# Altium project open-drain_arduino.PrjPcb
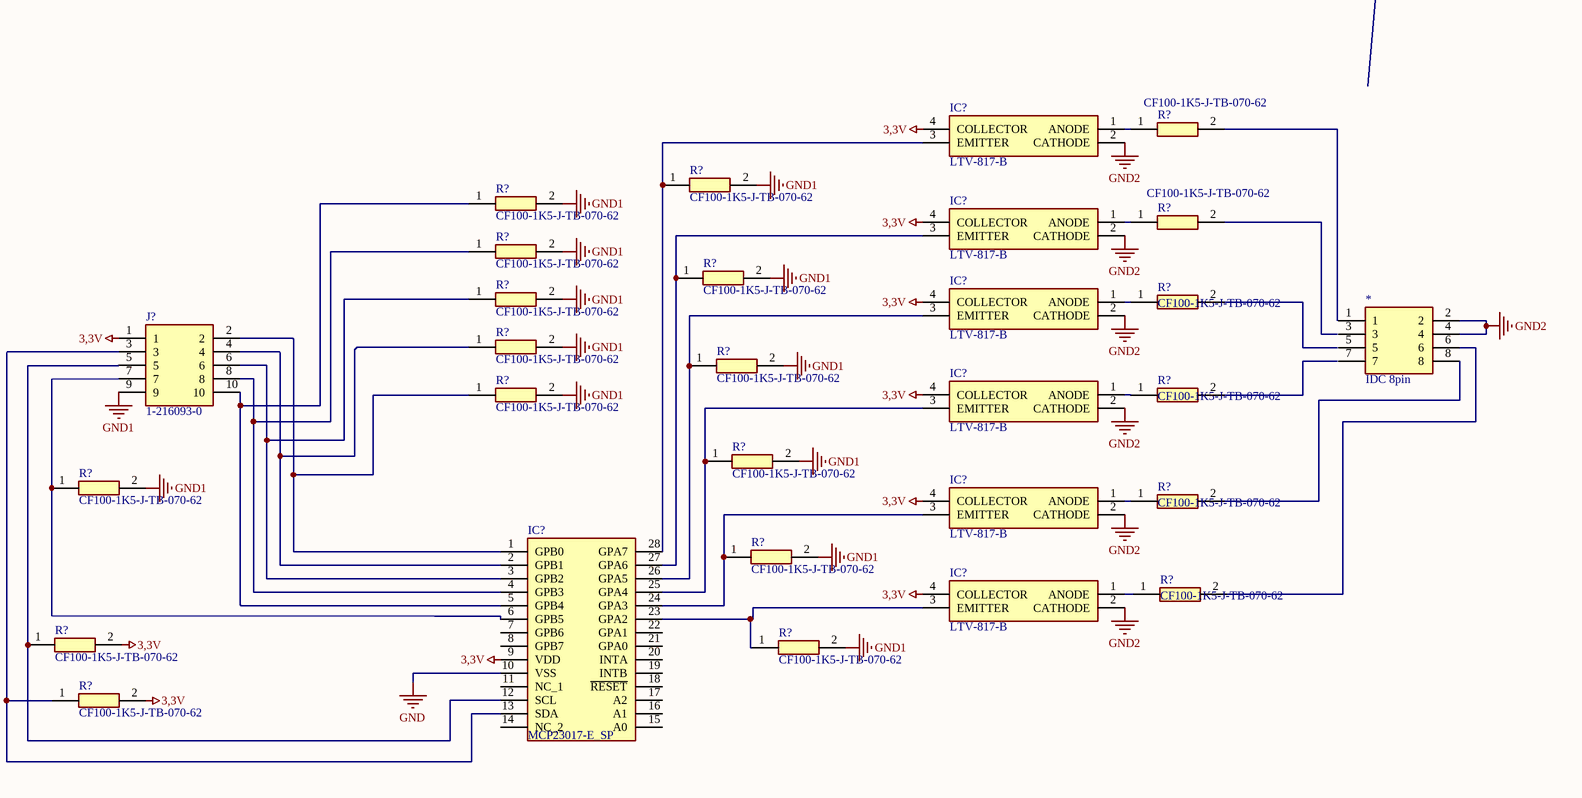
[diagram p0: optrons_and_mcp.SchDoc, bottom right]
2 sheets, 100 parts. Net scope: global (net labels, ports and power ports of the same name join across sheets).
Sheets:
  optrons_and_mcp.SchDoc
  Sheet2.SchDoc

## Sheet optrons_and_mcp.SchDoc
size A3

### Parts
(Parts that share a designator on the sheet are numbered #1, #2 ... from top to bottom, then left to right.)
*#1  IDC 8pin
IC?#1  LTV-817-B  [DIP762W60P254L460H420Q4N]
IC?#2  LTV-817-B  [DIP762W60P254L460H420Q4N]
IC?#3  LTV-817-B  [DIP762W60P254L460H420Q4N]
IC?#4  LTV-817-B  [DIP762W60P254L460H420Q4N]
IC?#5  LTV-817-B  [DIP762W60P254L460H420Q4N]
IC?#6  MCP23017-E_SP  [DIP794W56P254L3486H508Q28N]
IC?#7  LTV-817-B  [DIP762W60P254L460H420Q4N]
J?  1-216093-0  [12160930]
R?#1  CF100-1K5-J-TB-070-62  [RESAD2700W60L1100D400]
R?#2  CF100-1K5-J-TB-070-62  [RESAD2700W60L1100D400]
R?#3  CF100-1K5-J-TB-070-62  [RESAD2700W60L1100D400]
R?#4  CF100-1K5-J-TB-070-62  [RESAD2700W60L1100D400]
R?#5  CF100-1K5-J-TB-070-62  [RESAD2700W60L1100D400]
R?#6  CF100-1K5-J-TB-070-62  [RESAD2700W60L1100D400]
R?#7  CF100-1K5-J-TB-070-62  [RESAD2700W60L1100D400]
R?#8  CF100-1K5-J-TB-070-62  [RESAD2700W60L1100D400]
R?#9  CF100-1K5-J-TB-070-62  [RESAD2700W60L1100D400]
R?#10  CF100-1K5-J-TB-070-62  [RESAD2700W60L1100D400]
R?#11  CF100-1K5-J-TB-070-62  [RESAD2700W60L1100D400]
R?#12  CF100-1K5-J-TB-070-62  [RESAD2700W60L1100D400]
R?#13  CF100-1K5-J-TB-070-62  [RESAD2700W60L1100D400]
R?#14  CF100-1K5-J-TB-070-62  [RESAD2700W60L1100D400]
R?#15  CF100-1K5-J-TB-070-62  [RESAD2700W60L1100D400]
R?#16  CF100-1K5-J-TB-070-62  [RESAD2700W60L1100D400]
R?#17  CF100-1K5-J-TB-070-62  [RESAD2700W60L1100D400]
R?#18  CF100-1K5-J-TB-070-62  [RESAD2700W60L1100D400]
R?#19  CF100-1K5-J-TB-070-62  [RESAD2700W60L1100D400]
R?#20  CF100-1K5-J-TB-070-62  [RESAD2700W60L1100D400]

### Nets
3,3V: IC?#2.4(COLLECTOR) IC?#3.4(COLLECTOR) IC?#4.4(COLLECTOR) IC?#5.4(COLLECTOR) IC?#6.9(VDD) IC?#7.4(COLLECTOR) J?.1 R?#18.2 R?#20.2
GND: IC?#6.10(VSS)
GND1: J?.9 R?#2.2 R?#3.2 R?#5.2 R?#6.2 R?#7.2 R?#9.2 R?#10.2 R?#11.2 R?#13.2 R?#14.2 R?#16.2 R?#19.2
GND2: *#1.2 *#1.4 IC?#1.2(CATHODE) IC?#2.2(CATHODE) IC?#3.2(CATHODE) IC?#4.2(CATHODE) IC?#5.2(CATHODE) IC?#7.2(CATHODE)
Net*#1_6: *#1.6 R?#17.2
Net*#1_8: *#1.8 R?#15.2
NetIC?#1_1: IC?#1.1(ANODE) R?#1.1
NetIC?#1_3: IC?#1.3(EMITTER) IC?#6.28(GPA7) R?#2.1
NetIC?#2_1: IC?#2.1(ANODE) R?#4.1
NetIC?#2_3: IC?#2.3(EMITTER) IC?#6.27(GPA6) R?#6.1
NetIC?#3_1: IC?#3.1(ANODE) R?#8.1
NetIC?#3_3: IC?#3.3(EMITTER) IC?#6.26(GPA5) R?#10.1
NetIC?#4_1: IC?#4.1(ANODE) R?#12.1
NetIC?#4_3: IC?#4.3(EMITTER) IC?#6.25(GPA4) R?#13.1
NetIC?#5_1: IC?#5.1(ANODE) R?#15.1
NetIC?#5_3: IC?#5.3(EMITTER) IC?#6.24(GPA3) R?#16.1
NetIC?#6_1: IC?#6.1(GPB0) J?.2 R?#11.1
NetIC?#6_2: IC?#6.2(GPB1) J?.4 R?#9.1
NetIC?#6_3: IC?#6.3(GPB2) J?.6 R?#7.1
NetIC?#6_4: IC?#6.4(GPB3) J?.8 R?#5.1
NetIC?#6_5: IC?#6.5(GPB4) J?.10 R?#3.1
NetIC?#6_6: IC?#6.6(GPB5) J?.7 R?#14.1
NetIC?#6_12: IC?#6.12(SCL) J?.5 R?#18.1
NetIC?#6_13: IC?#6.13(SDA) J?.3 R?#20.1
NetIC?#6_23: IC?#6.23(GPA2) IC?#7.3(EMITTER) R?#19.1
NetIC?#7_1: IC?#7.1(ANODE) R?#17.1

Not connected (* = marked no-connect by the designer): *#1 1 3 5 7; IC?#1 4(COLLECTOR); IC?#6 7(GPB6) 8(GPB7) 11(NC_1) 14(NC_2) 15(A0) 16(A1) 17(A2) 18(~{RESET}) 19(INTB) 20(INTA) 21(GPA0) 22(GPA1); R?#1 2; R?#4 2; R?#8 2; R?#12 2

### Notes on the sheet
- Labels drawn without touching a wire or pin: 3,3V

### Library data of the parts
IC?#1-IC?#5 IC?#7 = LTV-817-B: Integrated Circuit; Manufacturer_Name: Lite-On; Datasheet Link: http://optoelectronics.liteon.com/upload/download/DS-70-96-0016/LTV-8X7%20series%20201610%20.pdf; Height: 4.2mm; Manufacturer_Part_Number: LTV-817-B; Mouser Part Number: N/A; Mouser Price/Stock: https://www.mouser.co.uk/ProductDetail/Lite-On/LTV-817-B?qs=5Clb0NIqk7HzP4M9tIz87Q%3D%3D; Arrow Part Number: LTV-817-B; Arrow Price/Stock: https://www.arrow.com/en/products/ltv-817-b/lite-on-technology
IC?#6 = MCP23017-E_SP: Integrated Circuit; Manufacturer_Name: Microchip; Manufacturer_Part_Number: MCP23017-E/SP; Datasheet Link: http://docs-emea.rs-online.com/webdocs/137e/0900766b8137eed4.pdf; Height: 5.08mm; Mouser Part Number: 579-MCP23017-E/SP; Mouser Price/Stock: https://www.mouser.co.uk/ProductDetail/Microchip-Technology/MCP23017-E-SP?qs=usxtMOJb1RyESXZDw7ia5A%3D%3D; Arrow Part Number: MCP23017-E/SP; Arrow Price/Stock: https://www.arrow.com/en/products/mcp23017-esp/microchip-technology
J? = 1-216093-0: Connector; Manufacturer_Name: TE Connectivity; Datasheet Link: https://componentsearchengine.com/Datasheets/2/1-216093-0.pdf; Height: 6.8mm; Manufacturer_Part_Number: 1-216093-0; Mouser Part Number: 571-1-216093-0; Mouser Price/Stock: https://www.mouser.co.uk/ProductDetail/TE-Connectivity/1-216093-0?qs=m7RwewakXS%2F9HSJylQnIAQ%3D%3D; Arrow Part Number: 1-216093-0; Arrow Price/Stock: https://www.arrow.com/en/products/1-216093-0/te-connectivity
R?#1-R?#20 = CF100-1K5-J-TB-070-62: Resistor; Manufacturer_Name: HKR; Datasheet Link: http://www.hkresistors.com/img2015/CF_BULK_PACKING_DATA_SHEET_2015_Copper_WIRE.pdf; Manufacturer_Part_Number: CF100-1K5-J-TB-070-62

## Sheet Sheet2.SchDoc
size A3
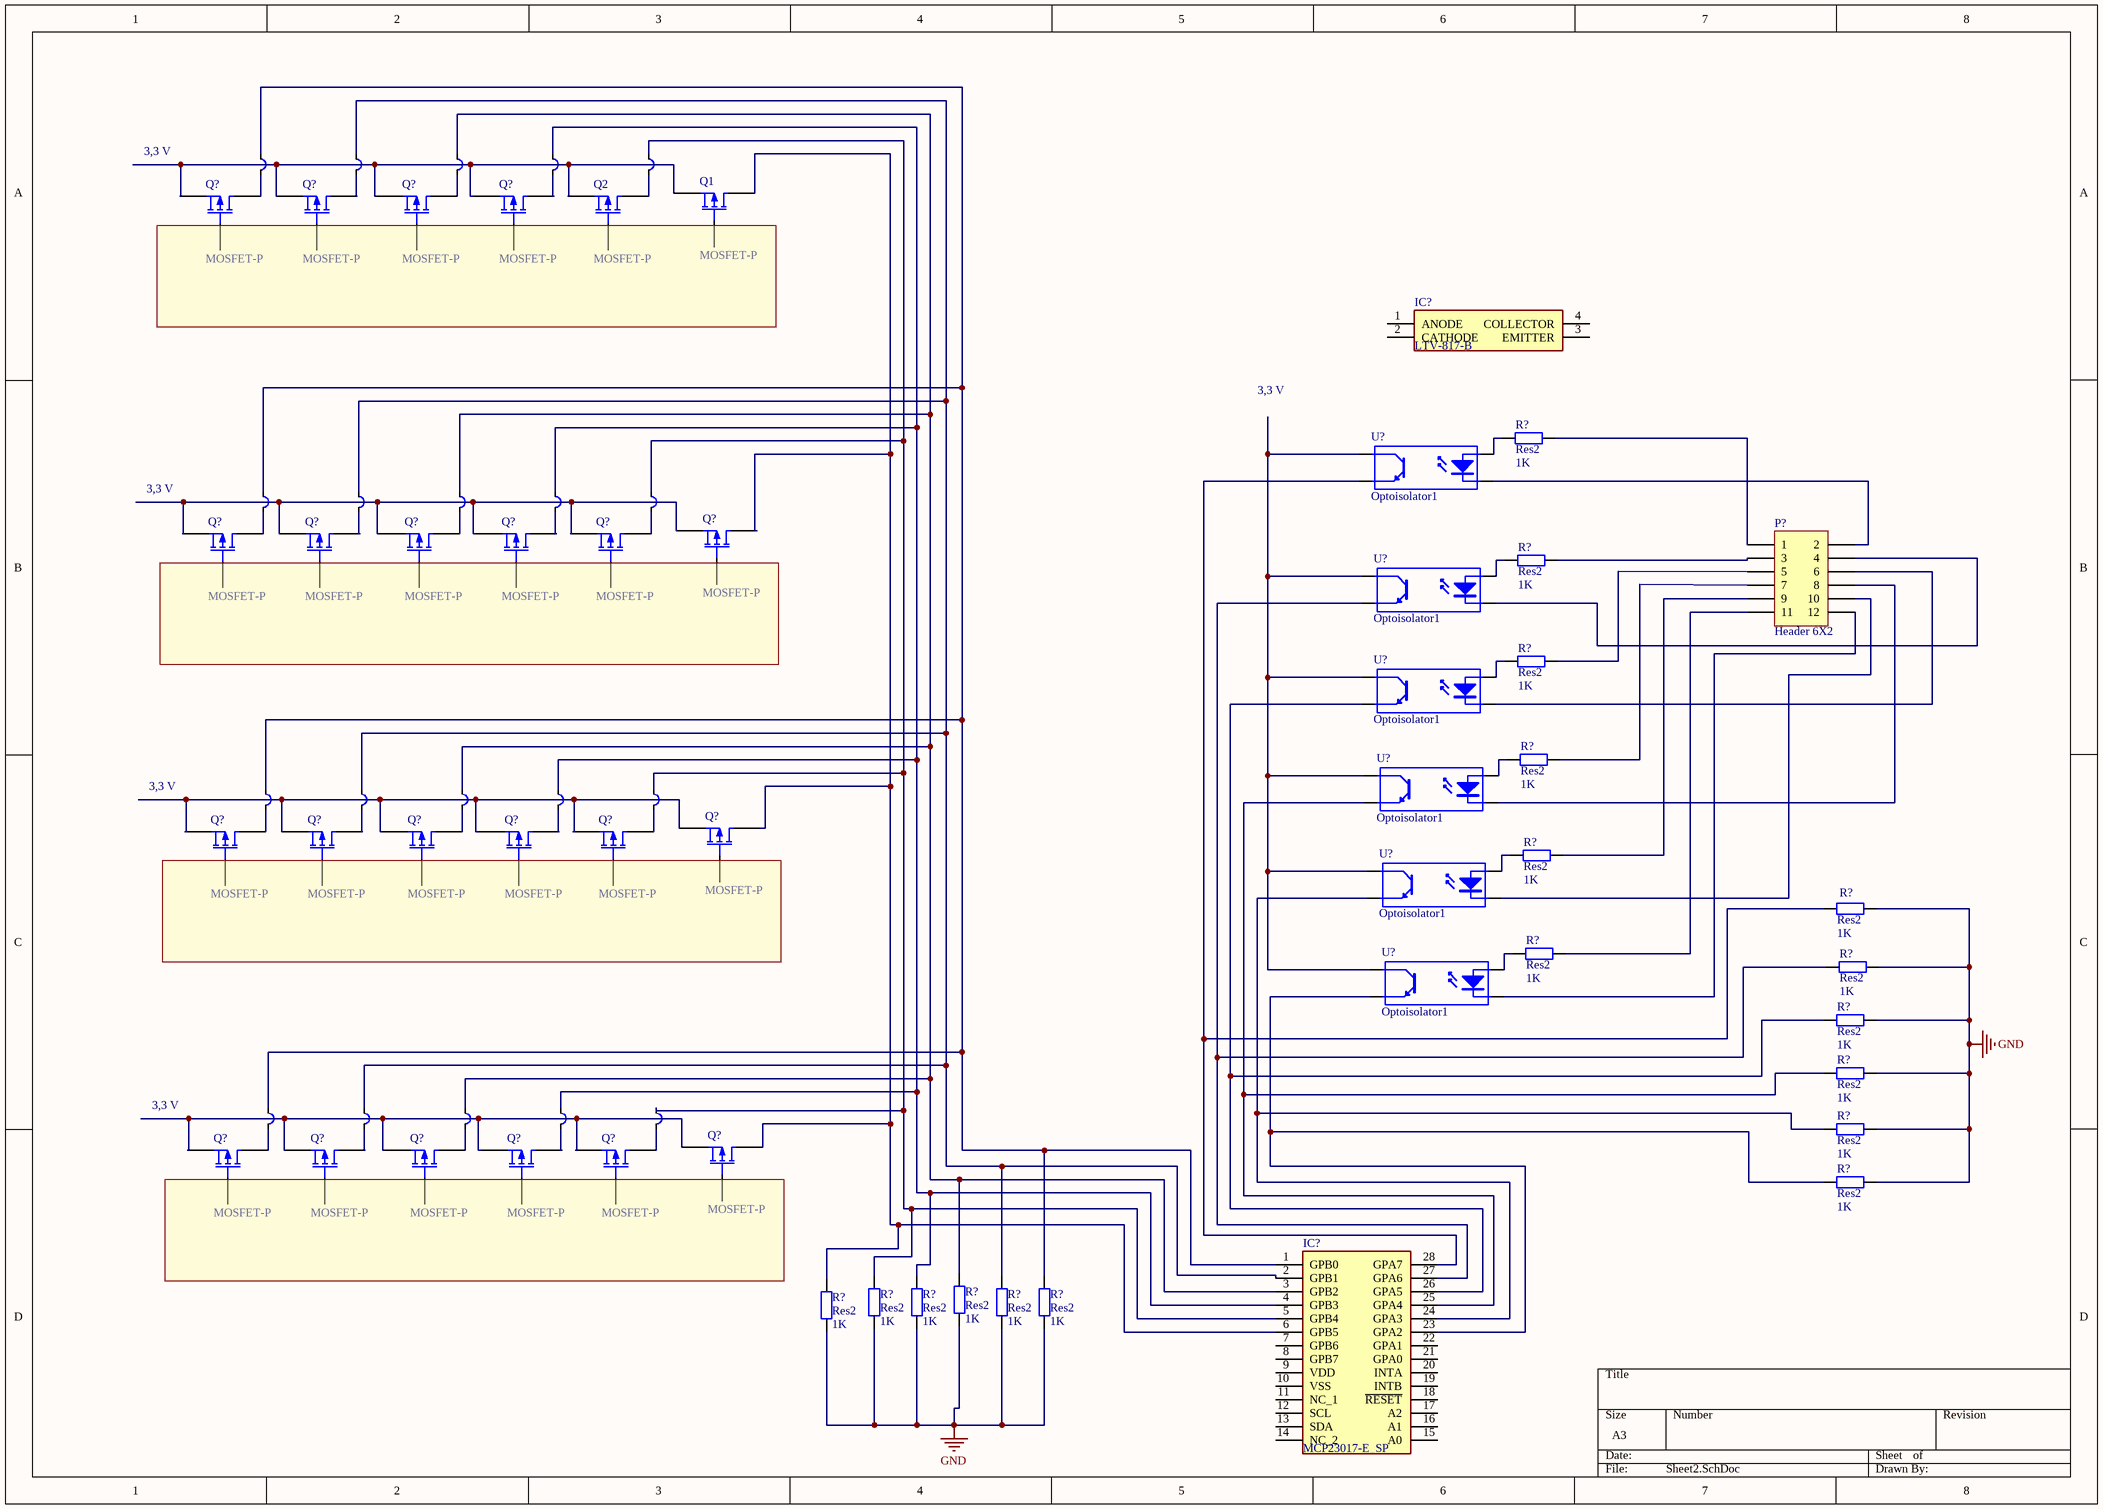
[diagram p1: Sheet2.SchDoc]

### Parts
(Parts that share a designator on the sheet are numbered #1, #2 ... from top to bottom, then left to right.)
*#2  wire_lope  (value not drawn)
*?#1  wire_lope  (value not drawn)
*?#2  wire_lope  (value not drawn)
*?#3  wire_lope  (value not drawn)
*?#4  wire_lope  (value not drawn)
*?#5  wire_lope  (value not drawn)
*?#6  wire_lope  (value not drawn)
*?#7  wire_lope  (value not drawn)
*?#8  wire_lope  (value not drawn)
*?#9  wire_lope  (value not drawn)
*?#10  wire_lope  (value not drawn)
*?#11  wire_lope  (value not drawn)
*?#12  wire_lope  (value not drawn)
*?#13  wire_lope  (value not drawn)
*?#14  wire_lope  (value not drawn)
*?#15  wire_lope  (value not drawn)
*?#16  wire_lope  (value not drawn)
*?#17  wire_lope  (value not drawn)
*?#18  wire_lope  (value not drawn)
*?#19  wire_lope  (value not drawn)
IC?#8  LTV-817-B  [DIP762W60P254L460H420Q4N]
IC?#9  MCP23017-E_SP  [DIP794W56P254L3486H508Q28N]
P?  Header 6X2  [HDR2X6]
Q1  MOSFET-P  [E3]
Q2  MOSFET-P  [E3]
Q?#1  MOSFET-P  [E3]
Q?#2  MOSFET-P  [E3]
Q?#3  MOSFET-P  [E3]
Q?#4  MOSFET-P  [E3]
Q?#5  MOSFET-P  [E3]
Q?#6  MOSFET-P  [E3]
Q?#7  MOSFET-P  [E3]
Q?#8  MOSFET-P  [E3]
Q?#9  MOSFET-P  [E3]
Q?#10  MOSFET-P  [E3]
Q?#11  MOSFET-P  [E3]
Q?#12  MOSFET-P  [E3]
Q?#13  MOSFET-P  [E3]
Q?#14  MOSFET-P  [E3]
Q?#15  MOSFET-P  [E3]
Q?#16  MOSFET-P  [E3]
Q?#17  MOSFET-P  [E3]
Q?#18  MOSFET-P  [E3]
Q?#19  MOSFET-P  [E3]
Q?#20  MOSFET-P  [E3]
Q?#21  MOSFET-P  [E3]
Q?#22  MOSFET-P  [E3]
R?#21  Res2  value 1K  [AXIAL-0.4]
R?#22  Res2  value 1K  [AXIAL-0.4]
R?#23  Res2  value 1K  [AXIAL-0.4]
R?#24  Res2  value 1K  [AXIAL-0.4]
R?#25  Res2  value 1K  [AXIAL-0.4]
R?#26  Res2  value 1K  [AXIAL-0.4]
R?#27  Res2  value 1K  [AXIAL-0.4]
R?#28  Res2  value 1K  [AXIAL-0.4]
R?#29  Res2  value 1K  [AXIAL-0.4]
R?#30  Res2  value 1K  [AXIAL-0.4]
R?#31  Res2  value 1K  [AXIAL-0.4]
R?#32  Res2  value 1K  [AXIAL-0.4]
R?#33  Res2  value 1K  [AXIAL-0.4]
R?#34  Res2  value 1K  [AXIAL-0.4]
R?#35  Res2  value 1K  [AXIAL-0.4]
R?#36  Res2  value 1K  [AXIAL-0.4]
R?#37  Res2  value 1K  [AXIAL-0.4]
R?#38  Res2  value 1K  [AXIAL-0.4]
U?#1  Optoisolator1  [DIP-4]
U?#2  Optoisolator1  [DIP-4]
U?#3  Optoisolator1  [DIP-4]
U?#4  Optoisolator1  [DIP-4]
U?#5  Optoisolator1  [DIP-4]
U?#6  Optoisolator1  [DIP-4]

### Nets
GND: R?#26.1 R?#28.1 R?#29.1 R?#30.1 R?#31.1 R?#32.1 R?#33.1 R?#34.1 R?#35.1 R?#36.1 R?#37.1 R?#38.1
Net*#2_6: *#2.6 *?#8.6 *?#13.6 *?#18.6 IC?#9.4(GPB3) R?#34.2
Net*#2_7: *#2.7 Q?#4.1(D)
Net*?#1_6: *?#1.6 *?#5.6 *?#10.6 *?#15.6 IC?#9.1(GPB0) R?#37.2
Net*?#1_7: *?#1.7 Q?#1.1(D)
Net*?#2_6: *?#2.6 *?#6.6 *?#11.6 *?#16.6 IC?#9.2(GPB1) R?#36.2
Net*?#2_7: *?#2.7 Q?#2.1(D)
Net*?#3_6: *?#3.6 *?#7.6 *?#12.6 *?#17.6 IC?#9.3(GPB2) R?#35.2
Net*?#3_7: *?#3.7 Q?#3.1(D)
Net*?#4_6: *?#4.6 *?#9.6 *?#14.6 *?#19.6 IC?#9.5(GPB4) R?#33.2
Net*?#4_7: *?#4.7 Q2.1(D)
Net*?#5_7: *?#5.7 Q?#5.1(D)
Net*?#6_7: *?#6.7 Q?#6.1(D)
Net*?#7_7: *?#7.7 Q?#7.1(D)
Net*?#8_7: *?#8.7 Q?#8.1(D)
Net*?#9_7: *?#9.7 Q?#9.1(D)
Net*?#10_7: *?#10.7 Q?#11.1(D)
Net*?#11_7: *?#11.7 Q?#12.1(D)
Net*?#12_7: *?#12.7 Q?#13.1(D)
Net*?#13_7: *?#13.7 Q?#14.1(D)
Net*?#14_7: *?#14.7 Q?#15.1(D)
Net*?#15_7: *?#15.7 Q?#18.1(D)
Net*?#16_7: *?#16.7 Q?#19.1(D)
Net*?#17_7: *?#17.7 Q?#20.1(D)
Net*?#18_7: *?#18.7 Q?#21.1(D)
Net*?#19_7: *?#19.7 Q?#22.1(D)
NetIC?#9_6: IC?#9.6(GPB5) Q1.1(D) Q?#10.1(D) Q?#16.1(D) Q?#17.1(D) R?#38.2
NetIC?#9_23: IC?#9.23(GPA2) R?#32.2 U?#6.3(E)
NetIC?#9_24: IC?#9.24(GPA3) R?#31.2 U?#5.3(E)
NetIC?#9_25: IC?#9.25(GPA4) R?#30.2 U?#4.3(E)
NetIC?#9_26: IC?#9.26(GPA5) R?#29.2 U?#3.3(E)
NetIC?#9_27: IC?#9.27(GPA6) R?#28.2 U?#2.3(E)
NetIC?#9_28: IC?#9.28(GPA7) R?#26.2 U?#1.3(E)
NetP?_1: P?.1 R?#21.1
NetP?_2: P?.2 U?#1.2(K)
NetP?_3: P?.3 R?#22.1
NetP?_4: P?.4 U?#2.2(K)
NetP?_5: P?.5 R?#23.1
NetP?_6: P?.6 U?#3.2(K)
NetP?_7: P?.7 R?#24.1
NetP?_8: P?.8 U?#4.2(K)
NetP?_9: P?.9 R?#25.1
NetP?_10: P?.10 U?#5.2(K)
NetP?_11: P?.11 R?#27.1
NetP?_12: P?.12 U?#6.2(K)
NetQ1_3: Q1.3(S) Q2.3(S) Q?#1.3(S) Q?#2.3(S) Q?#3.3(S) Q?#4.3(S)
NetQ?#5_3: Q?#5.3(S) Q?#6.3(S) Q?#7.3(S) Q?#8.3(S) Q?#9.3(S) Q?#10.3(S)
NetQ?#11_3: Q?#11.3(S) Q?#12.3(S) Q?#13.3(S) Q?#14.3(S) Q?#15.3(S) Q?#16.3(S)
NetQ?#17_3: Q?#17.3(S) Q?#18.3(S) Q?#19.3(S) Q?#20.3(S) Q?#21.3(S) Q?#22.3(S)
NetR?#21_2: R?#21.2 U?#1.1(A)
NetR?#22_2: R?#22.2 U?#2.1(A)
NetR?#23_2: R?#23.2 U?#3.1(A)
NetR?#24_2: R?#24.2 U?#4.1(A)
NetR?#25_2: R?#25.2 U?#5.1(A)
NetR?#27_2: R?#27.2 U?#6.1(A)
NetU?#1_4: U?#1.4(C) U?#2.4(C) U?#3.4(C) U?#4.4(C) U?#5.4(C) U?#6.4(C)

Not connected (* = marked no-connect by the designer): IC?#8 1(ANODE) 2(CATHODE) 3(EMITTER) 4(COLLECTOR); IC?#9 7(GPB6) 8(GPB7) 9(VDD) 10(VSS) 11(NC_1) 12(SCL) 13(SDA) 14(NC_2) 15(A0) 16(A1) 17(A2) 18(~{RESET}) 19(INTB) 20(INTA) 21(GPA0) 22(GPA1); Q1 2(G); Q2 2(G); Q?#1 2(G); Q?#2 2(G); Q?#3 2(G); Q?#4 2(G); Q?#5 2(G); Q?#6 2(G); Q?#7 2(G); Q?#8 2(G); Q?#9 2(G); Q?#10 2(G); Q?#11 2(G); Q?#12 2(G); Q?#13 2(G); Q?#14 2(G); Q?#15 2(G); Q?#16 2(G); Q?#17 2(G); Q?#18 2(G); Q?#19 2(G); Q?#20 2(G); Q?#21 2(G); Q?#22 2(G)

### Notes on the sheet
- (near Q?#1) 3,3 V
- 3,3 V
- (near Q?#5) 3,3 V
- (near Q?#11) 3,3 V
- (near Q?#18) 3,3 V

### Library data of the parts
IC?#8 = LTV-817-B: as IC?#1 on sheet optrons_and_mcp; Datasheet Link: http://optoelectronics.liteon.com/upload/download/DS-70-96-0016/LTV-8X7%20series%20201610%20.pdf; Height: 4.2mm; Manufacturer_Part_Number: LTV-817-B; Mouser Part Number: N/A; Mouser Price/Stock: https://www.mouser.co.uk/ProductDetail/Lite-On/LTV-817-B?qs=5Clb0NIqk7HzP4M9tIz87Q%3D%3D; Arrow Part Number: LTV-817-B; Arrow Price/Stock: https://www.arrow.com/en/products/ltv-817-b/lite-on-technology
IC?#9 = MCP23017-E_SP: as IC?#6 on sheet optrons_and_mcp; Datasheet Link: http://docs-emea.rs-online.com/webdocs/137e/0900766b8137eed4.pdf; Height: 5.08mm; Mouser Part Number: 579-MCP23017-E/SP; Mouser Price/Stock: https://www.mouser.co.uk/ProductDetail/Microchip-Technology/MCP23017-E-SP?qs=usxtMOJb1RyESXZDw7ia5A%3D%3D; Arrow Part Number: MCP23017-E/SP; Arrow Price/Stock: https://www.arrow.com/en/products/mcp23017-esp/microchip-technology
P? = Header 6X2: Header, 6-Pin, Dual row; LatestRevisionDate: 17-Jul-2002; LatestRevisionNote: Re-released for DXP Platform.; Publisher: Altium Limited
Q1 Q2 Q?#1-Q?#22 = MOSFET-P: P-Channel MOSFET; Published: 8-Jun-2000; LatestRevisionDate: 17-Jul-2002; LatestRevisionNote: Re-released for DXP Platform.; PackageVersion: 1995/1996; PackageReference: E3; Publisher: Altium Limited; PackageDescription: TO, Flat Index; 3 In-Line, Axial Leads; Body Dia. 4.6mm; Lead Dia. 0.5 mm (max)
R?#21-R?#38 = Res2: Resistor; Published: 8-Jun-2000; LatestRevisionDate: 17-Jul-2002; LatestRevisionNote: Re-released for DXP Platform.; PackageReference: AXIAL-0.4; Publisher: Altium Limited; PackageDescription: Axial Device, Thru-Hole; 2 Leads; 0.4 in Pin Spacing
U?#1-U?#6 = Optoisolator1: 4-Pin Phototransistor Optocoupler; Published: 24-Mar-1999; LatestRevisionDate: 04-Mar-2005; LatestRevisionNote: Sch pins 3 & 4 Swapped.; DatasheetVersion: Nov-2003; PackageReference: DIP-4; Publisher: Altium Limited

## Nets that join several sheets
GND: optrons_and_mcp (IC?#6.10), Sheet2 (12 pins)